# EAGLE schematic controller8 (EAGLE 8.1.0)

## Sheet 1 of 2
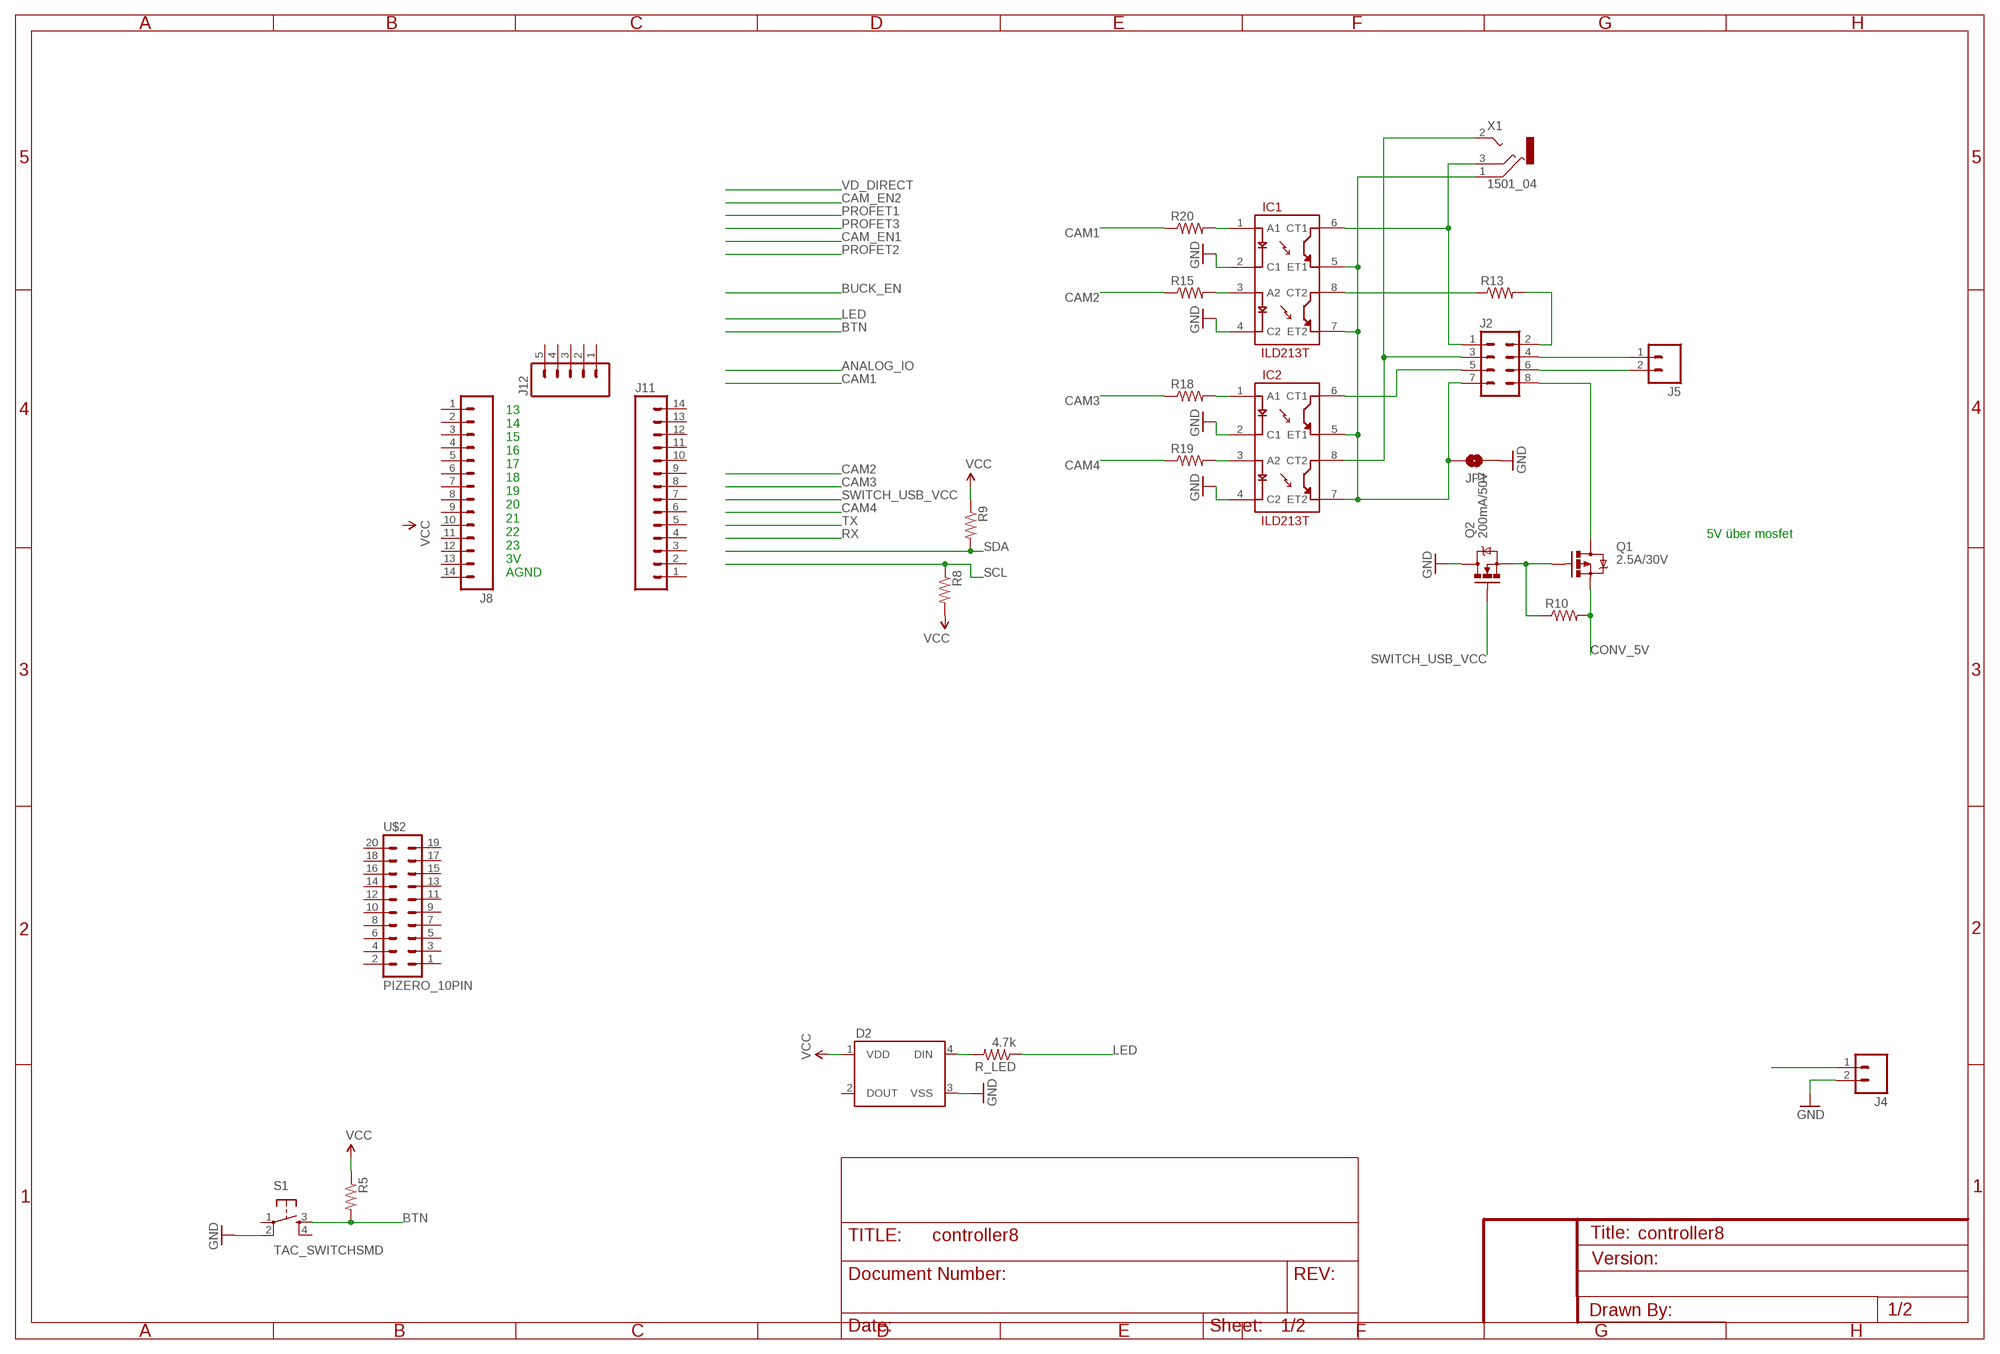
[diagram p0: schematic, sheet 1]

### Parts
D2  WS2812B  [WS2812B]
IC1  ILD213T  [SO08]
IC2  ILD213T  [SO08]
J2  M04X2  [2X4]
J4  M02PTH  [1X02]
J5  M02PTH  [1X02]
J8  M14LOCK  [1X14_LOCK]
J11  M14LOCK  [1X14_LOCK]
J12  M05LOCK  [1X05_LOCK]
JP1  JUMPER-PAD-2-NOYES_SILK  [PAD-JUMPER-2-NO_YES_SILK]
Q1  2.5A/30V  MOSFET-PCHANNELDMG2307L  [SOT23-3]
Q2  200mA/50V  MOSFET-NCHANNELBSS138  [SOT23-3]
R5  RESISTOR1206  [1206]
R8  RESISTOR1206  [1206]
R9  RESISTOR1206  [1206]
R10  RESISTOR0805-RES  [0805]
R13  RESISTOR1206  [1206]
R15  RESISTOR0805-RES  [0805]
R18  RESISTOR0805-RES  [0805]
R19  RESISTOR0805-RES  [0805]
R20  RESISTOR0805-RES  [0805]
R_LED  4.7k  RESISTOR1206  [1206]
S1  TAC_SWITCHSMD  TAC_SWITCHPTH  [TACTILE-PTH]
U$2  PIZERO_10PIN  [PIZERO_10PIN]
X1  1501_04  [1501_05]

### Nets
BTN: R5.2 S1.3
CAM1: R20.1
CAM2: R15.1
CAM3: R18.1
CAM4: R19.1
CONV_5V [power]: Q1.2(S) R10.2
GND [power]: D2.3(VSS) IC1.2(C1) IC1.4(C2) IC2.2(C1) IC2.4(C2) J4.2 JP1.1 Q2.3(D) S1.2
LED: R_LED.1
N$1: J2.4 J5.1
N$6: J2.6 J5.2
N$7: D2.4(DIN) R_LED.2
N$12: IC2.1(A1) R18.2
N$13: IC2.3(A2) R19.2
N$15: IC1.3(A2) R15.2
N$16: J2.2 R13.2
N$18: IC1.8(CT2) R13.1
N$19: IC1.1(A1) R20.2
N$31: IC1.6(CT1) J2.1 X1.3
N$32: IC2.8(CT2) J2.3 X1.2
N$33: IC2.6(CT1) J2.5
N$34: IC1.5(ET1) IC1.7(ET2) IC2.5(ET1) IC2.7(ET2) J2.7 JP1.2 X1.1
N$35: J2.8 Q1.3(D)
N$36: Q1.1(G) Q2.2(S) R10.1
N$39: J4.1
SCL: R8.1
SDA: R9.2
SWITCH_USB_VCC: Q2.1(G)
VCC [power]: D2.1(VDD) R5.1 R8.2 R9.1
Unconnected: D2.2(DOUT) J8.1 J8.2 J8.3 J8.4 J8.5 J8.6 J8.7 J8.8 J8.9 J8.10 J8.11 J8.12 J8.13 J8.14 J11.1 J11.2 J11.3 J11.4 J11.5 J11.6 J11.7 J11.8 J11.9 J11.10 J11.11 J11.12 J11.13 J11.14 J12.1 J12.2 J12.3 J12.4 J12.5 S1.1 S1.4 U$2.1 U$2.2 U$2.3 U$2.4 U$2.5 U$2.6 U$2.7 U$2.8 U$2.9 U$2.10 U$2.11 U$2.12 U$2.13 U$2.14 U$2.15 U$2.16 U$2.17 U$2.18 U$2.19 U$2.20

### Notes on the sheet
- 5V über mosfet
- 13
  14
  15
  16
  17
  18
  19
  20
  21
  22
  23
  3V
  AGND

## Sheet 2 of 2
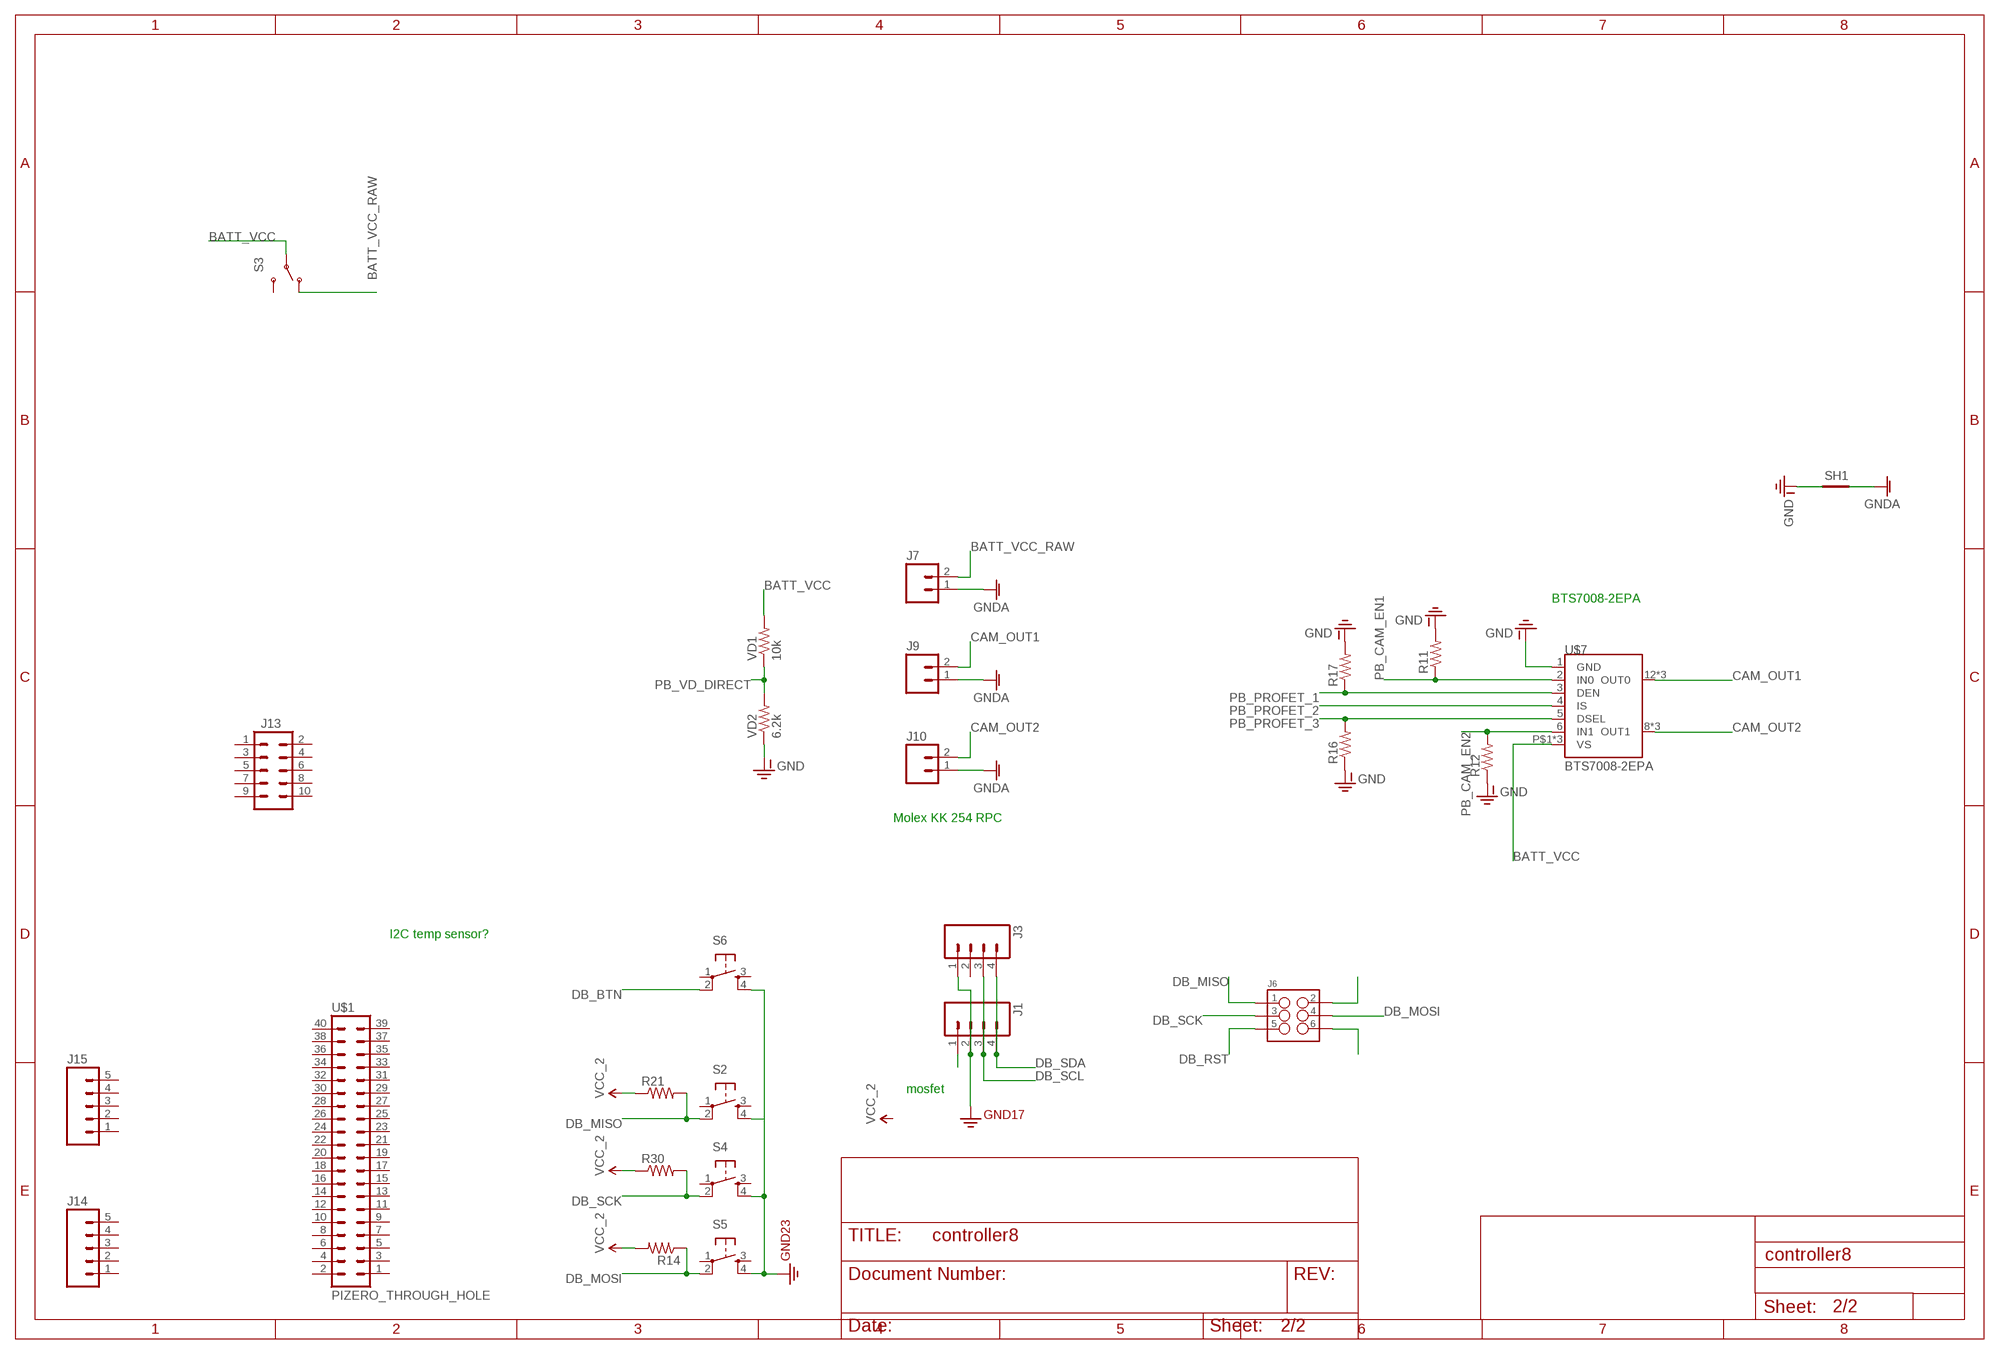
[diagram p1: schematic, sheet 2]

### Parts
J1  M04LOCK  [1X04_LOCK]
J3  M04LOCK  [1X04_LOCK]
J6  M03X2FEMALE  [2X3]
J7  M02LOCK  [1X02_LOCK]
J9  M02LOCK  [1X02_LOCK]
J10  M02LOCK  [1X02_LOCK]
J13  M05X2PTH  [AVR_ICSP]
J14  M05LOCK  [1X05_LOCK]
J15  M05LOCK  [1X05_LOCK]
R11  RESISTOR1206  [1206]
R12  RESISTOR1206  [1206]
R14  RESISTOR1206  [1206]
R16  RESISTOR1206  [1206]
R17  RESISTOR1206  [1206]
R21  RESISTOR1206  [1206]
R30  RESISTOR1206  [1206]
S2  TAC_SWITCHPTH  [TACTILE-PTH]
S3  SWITCH-SPDTPTH_LOCK  [SWITCH-SPDT_LOCK.007S]
S4  TAC_SWITCHPTH  [TACTILE-PTH]
S5  TAC_SWITCHPTH  [TACTILE-PTH]
S6  TAC_SWITCHPTH  [TACTILE-PTH]
SH1  SHORT-HT5  [SHORT_TOP-50]
U$1  PIZERO_THROUGH_HOLE  [PIZERO_THOUGH_HOLE]
U$7  BTS7008-2EPA  [SOIC-14-PAD]
VD1  10k  RESISTOR1206  [1206]
VD2  6.2k  RESISTOR1206  [1206]

### Nets
3.3V [power]: J1.2 J3.1 S2.4 S4.4 S5.4 S6.4 ; supply symbol labelled GND2
BATT_VCC [camera_power]: S3.2(P) U$7.P$1(VS) U$7.P$2(VS) U$7.VS VD1.2
BATT_VCC_RAW [camera_power]: J7.2 S3.1(O)
CAM_OUT1 [camera_power]: J9.2 U$7.12(OUT0) U$7.13(OUT0) U$7.14(OUT0)
CAM_OUT2 [camera_power]: J10.2 U$7.8(OUT1) U$7.9(OUT1) U$7.10(OUT1)
DB_BTN: S6.2
DB_MISO: J6.1 R21.2 S2.2
DB_MOSI: J6.4 R14.1 S5.2
DB_RST: J6.5
DB_SCK: J6.3 R30.2 S4.2
DB_SCL: J1.3 J3.3
DB_SDA: J1.4 J3.4
GND-ISO [power]: R11.2 R12.1 R16.1 R17.2 SH1.1 U$7.1(GND) VD2.1 ; supply symbol labelled GND
GNDA [camera_power]: J7.1 J9.1 J10.1 SH1.2
N$37 [camera_power]: J1.1
N$45: J6.2
N$46: J6.6
PB_CAM_EN1: R11.1 U$7.2(IN0)
PB_CAM_EN2: R12.2 U$7.6(IN1)
PB_PROFET_1: R17.1 U$7.3(DEN)
PB_PROFET_2: U$7.4(IS)
PB_PROFET_3: R16.2 U$7.5(DSEL)
PB_VD_DIRECT: VD1.1 VD2.2
VCC_2 [power]: R14.2 R21.1 R30.1
Unconnected: J3.2 J13.1 J13.2 J13.3 J13.4 J13.5 J13.6 J13.7 J13.8 J13.9 J13.10 J14.1 J14.2 J14.3 J14.4 J14.5 J15.1 J15.2 J15.3 J15.4 J15.5 S2.1 S2.3 S3.3(S) S4.1 S4.3 S5.1 S5.3 S6.1 S6.3 U$1.1 U$1.2 U$1.3 U$1.4 U$1.5 U$1.6 U$1.7 U$1.8 U$1.9 U$1.10 U$1.11 U$1.12 U$1.13 U$1.14 U$1.15 U$1.16 U$1.17 U$1.18 U$1.19 U$1.20 U$1.21 U$1.22 U$1.23 U$1.24 U$1.25 U$1.26 U$1.27 U$1.28 U$1.29 U$1.30 U$1.31 U$1.32 U$1.33 U$1.34 U$1.35 U$1.36 U$1.37 U$1.38 U$1.39 U$1.40

### Notes on the sheet
- BTS7008-2EPA
- Molex KK 254 RPC
- I2C temp sensor?
- mosfet

## Library data of the parts
D2 = SparkFun-LED:WS2812B: WS2812B - Intelligent control LED integrated light source Technical Specifications: Power Supply Voltage (VDD): 3.5 to 5.3 V Input Voltage (VI): -0.5 to VDD+0.5 V Operating Junction Temperature (Topt): -25°C to +80°C Storage Temperature Range (Tstg): -55°C to +150°C; PROD_ID: DIO-12503
IC1 IC2 = SparkFun-DiscreteSemi:ILD213T: Dual optoisolator.
J1 J3 = SparkFun-Connectors:M04: Header 4 Standard 4-pin 0.1" header. Use with straight break away headers (SKU : PRT-00116), right angle break away headers (PRT-00553), swiss pins (PRT-00743), machine pins (PRT-00117), and female headers (PRT-00115). Molex polarized connector foot print use with SKU : PRT-08231 with associated crimp pins and housings. 1MM SMD Version SKU: PRT-10208; PROD_ID: CONN-09696
J2 = SparkFun-Connectors:M04X2: .1" header, two rows of four.
J4 J5 J7 J9 J10 = SparkFun-Connectors:M02: Standard 2-pin 0.1" header. Use with - straight break away headers ( PRT-00116) - right angle break away headers (PRT-00553) - swiss pins (PRT-00743) - machine pins (PRT-00117) - female headers (PRT-00115) Molex polarized connector foot print use with: PRT-08233 with associated crimp pins and housings. 2.54_SCREWTERM for use with PRT-10571. 3.5mm Screw Terminal footprints for PRT-08084 5mm Screw Terminal footprints for use with PRT-08432
J6 = SparkFun-Connectors:M03X2: 2x3 .1" header. Shrouded, with keying- CONN-10681 SMT- CONN-11415 Pogo pins- HW-11044; PROD_ID: CONN-11566; VALUE: FEMALE 2x3
J8 J11 = SparkFun-Connectors:M14: Header 14 Standard 14-pin 0.1" header. Use with straight break away headers (SKU : PRT-00116), right angle break away headers (PRT-00553), swiss pins (PRT-00743), machine pins (PRT-00117), and female headers (PRT-00115).
J12 J14 J15 = SparkFun-Connectors:M05: Header 5 Standard 5-pin 0.1" header. Use with straight break away headers (SKU : PRT-00116), right angle break away headers (PRT-00553), swiss pins (PRT-00743), machine pins (PRT-00117), and female headers (PRT-00115). Molex polarized connector foot print use with SKU : PRT-08230 with associated crimp pins and housings.
J13 = SparkFun-Connectors:M05X2: Header 5x2 Standard 10-pin dual row 0.1" header. Commonly used with AVR-ISP. Use with Spark Fun Electronics SKU: PRT-00778
JP1 = SparkFun-Passives:JUMPER-PAD-2-NO
Q1 = SparkFun-DiscreteSemi:MOSFET-PCHANNEL: Generic PMOSFET IRLML2244 - TRANS-11153 (SOT-23 -20V -4.3A) (1.Gate 2.Source 3.Drain) FQP27P06 - COM-10349 <http://www.sparkfun.com/products/10349> (TO-220 -60V -27A) (1.Gate 2.Source 3.Drain); PROD_ID: TRANS-11308
Q2 = SparkFun-DiscreteSemi:MOSFET-NCHANNEL: Common NMOSFET Parts MFG P/N Store ID Prod ID FDD8780 TRANS-09984 SI7820DN TRANS-11055 FDS6630A IC-08089 2N7002PW TRANS-11151 FQP30N06L COM-10213 TRANS-10060 BSS123LT1G TRANS-08345 BSS138 TRANS-00830 BS170 2N7000; PROD_ID: TRANS-00830
R5 R8-R21 R30 VD1 VD2 = SparkFun-Passives:RESISTOR: Resistor Basic schematic elements and footprints for 0603, 1206, and PTH resistors.
R_LED = SparkFun-Resistors:RESISTOR: Resistor Basic schematic elements and footprints for 0603, 1206, and PTH resistors.
S1 S2 S4-S6 = SparkFun-Retired:TAC_SWITCH: Momentary Switch Button commonly used for reset or general input. Spark Fun Electronics SKU : COM-00097 SMT- SWCH-08247
S3 = SparkFun-Electromechanical:SWITCH-SPDT: SPDT Switch Simple slide switch, Spark Fun Electronics SKU : COM-00102 DPDT SMT slide switch, AYZ0202, SWCH-08179
SH1 = shorts-old:SHORT-H: Short between two nets; BOM: no
U$1 = pizero:PIZERO_THROUGH_HOLE
U$2 = pizero:PIZERO_10PIN
U$7 = SparkFun-DigitalIC:BTS7008-2EPA
X1 = con-lumberg:1501_0*: Jack connectors according to JISC 6560, 2.5 mm Klinkensteckverbinder nach JISC 6560, 2,5 mm Source: http://www.lumberg.com/Produkte/PDFs/1501_05.pdfedit 1501_03 http://www.lumberg.com/Produkte/PDFs/1501_06.pdf; OC_FARNELL: 1216977; OC_NEWARK: unknown

## Net classes
0 default: width 0.254 mm, clearance 0.254 mm
1 power: width 0.356 mm, clearance 0.254 mm
2 camera_power: width 0.66 mm, clearance 0.254 mm
3 usbsignal: width 0.254 mm, clearance 0.203 mm